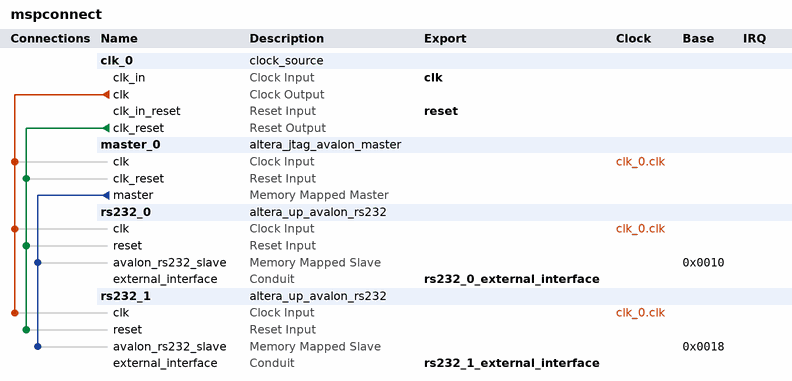
[diagram p0: system contents]
# Platform Designer (Qsys) system mspconnect, Cyclone V 5CSEMA5F31C6
# Parameters at their usual value, and those the tool derives, are not listed.
package require -exact qsys 16.0
create_system mspconnect
set_project_property DEVICE_FAMILY {Cyclone V}
set_project_property DEVICE 5CSEMA5F31C6

add_instance clk_0 clock_source 16.0
set_instance_parameter_value clk_0 clockFrequency 50000000

add_instance master_0 altera_jtag_avalon_master 16.0

add_instance rs232_0 altera_up_avalon_rs232 15.1
set_instance_parameter_value rs232_0 baud 115200
set_instance_parameter_value rs232_0 parity None

add_instance rs232_1 altera_up_avalon_rs232 15.1
set_instance_parameter_value rs232_1 baud 115200
set_instance_parameter_value rs232_1 parity None

# connections
add_connection clk_0.clk master_0.clk clock
add_connection clk_0.clk rs232_0.clk clock
add_connection clk_0.clk rs232_1.clk clock
add_connection clk_0.clk_reset master_0.clk_reset reset
add_connection clk_0.clk_reset rs232_0.reset reset
add_connection clk_0.clk_reset rs232_1.reset reset
add_connection master_0.master rs232_0.avalon_rs232_slave avalon
set_connection_parameter_value master_0.master/rs232_0.avalon_rs232_slave baseAddress 0x0010
add_connection master_0.master rs232_1.avalon_rs232_slave avalon
set_connection_parameter_value master_0.master/rs232_1.avalon_rs232_slave baseAddress 0x0018

# exported interfaces
add_interface clk clock sink
set_interface_property clk EXPORT_OF clk_0.clk_in
add_interface reset reset sink
set_interface_property reset EXPORT_OF clk_0.clk_in_reset
add_interface rs232_0_external_interface conduit end
set_interface_property rs232_0_external_interface EXPORT_OF rs232_0.external_interface
add_interface rs232_1_external_interface conduit end
set_interface_property rs232_1_external_interface EXPORT_OF rs232_1.external_interface

set_interconnect_requirement {$system} qsys_mm.clockCrossingAdapter HANDSHAKE
set_interconnect_requirement {$system} qsys_mm.enableEccProtection FALSE
set_interconnect_requirement {$system} qsys_mm.insertDefaultSlave FALSE
set_interconnect_requirement {$system} qsys_mm.maxAdditionalLatency 1

save_system mspconnect.qsys
